# Altium project bela_cape.PrjPcb
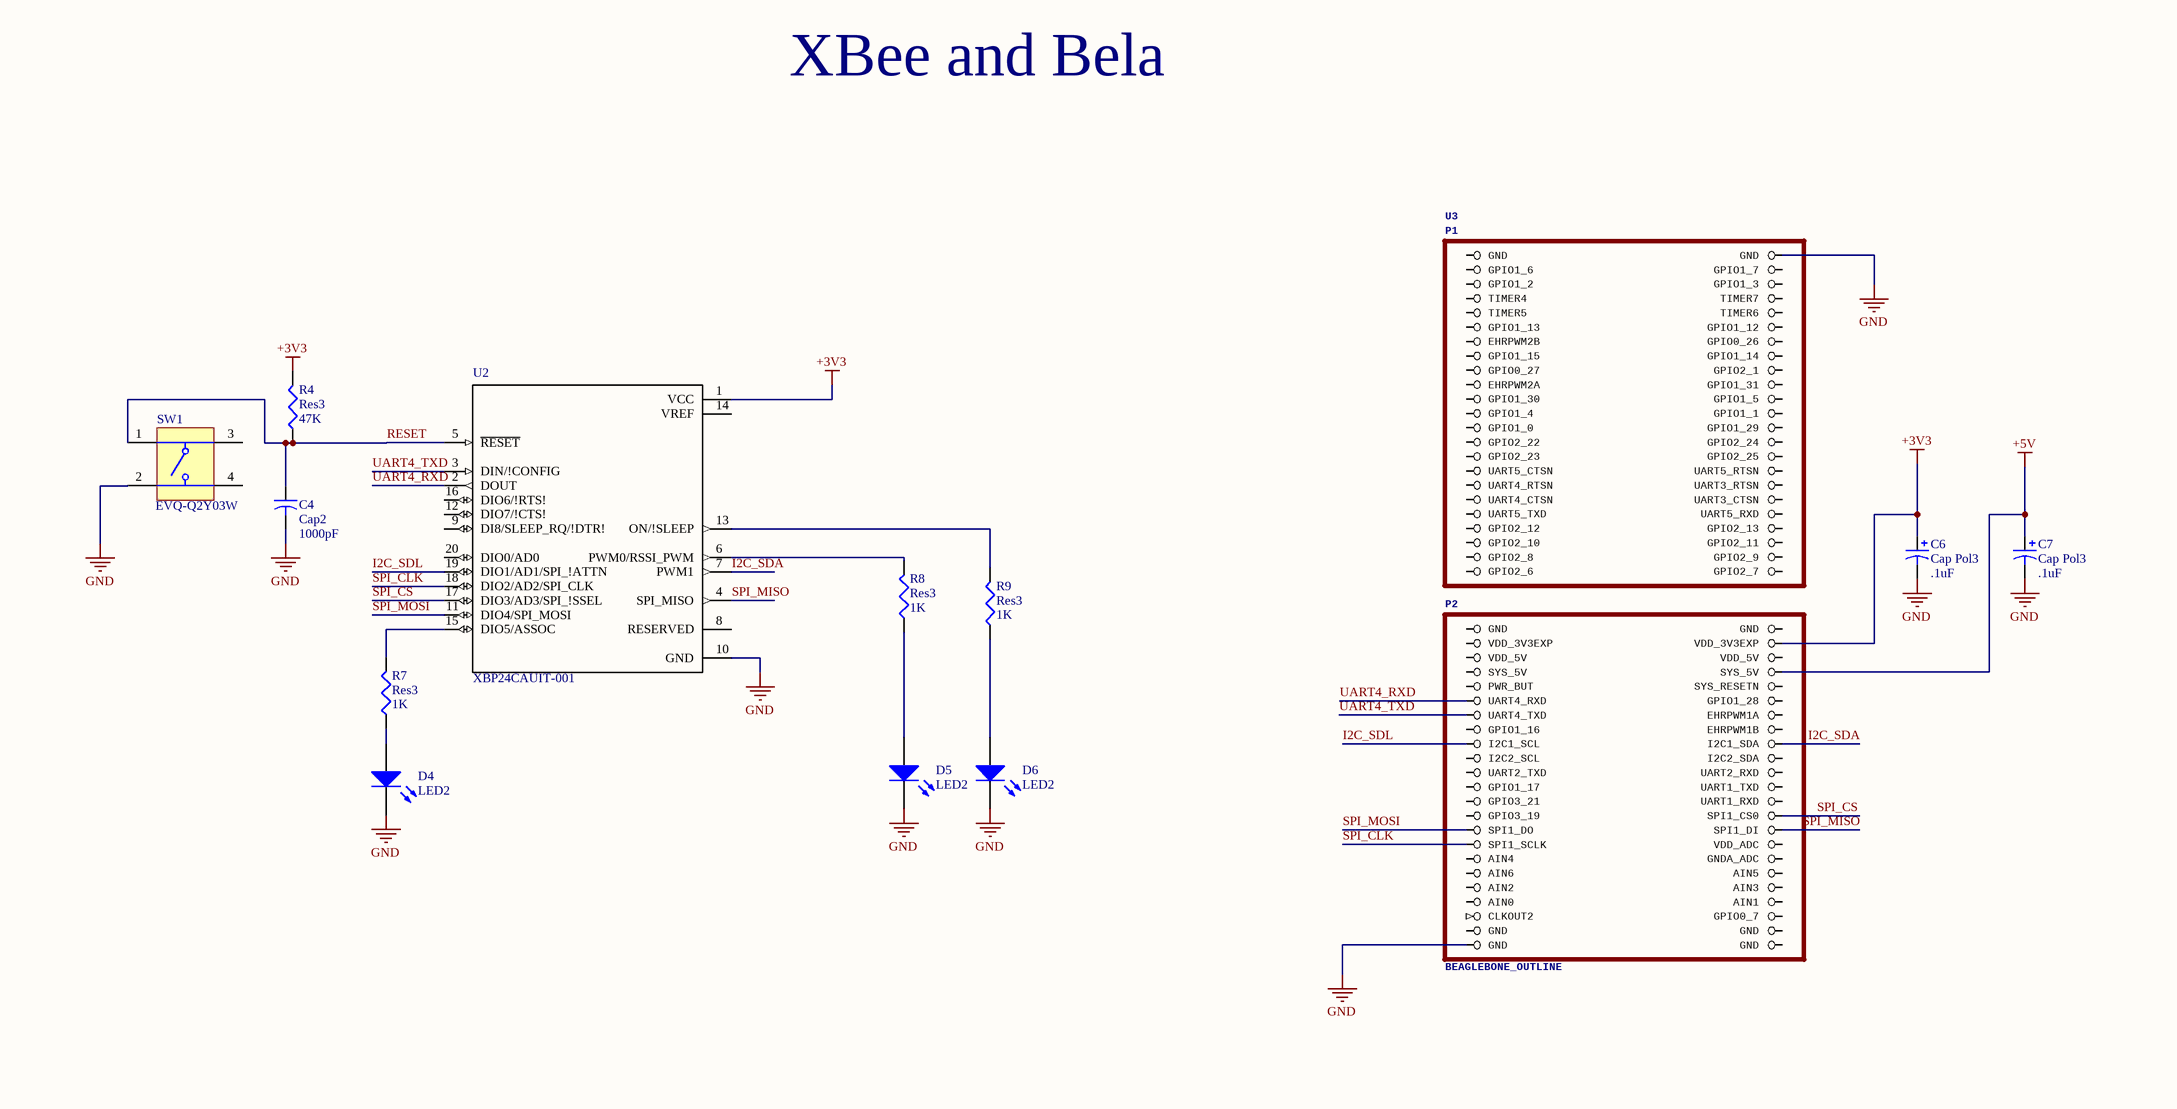
[diagram p0: bela_expansion_card_3.SchDoc]
3 sheets, 24 parts. Net scope: global (net labels, ports and power ports of the same name join across sheets).
Board file: bela_cape.PcbDoc
Sheets:
  bela_expansion_card_3.SchDoc
  bela_expansion_card_2.SchDoc
  bela_expansion_card_1.SchDoc

## Sheet bela_expansion_card_3.SchDoc
size 382 x 191 mm

### Parts
C4  Cap2  value 1000pF  [C0805]
C6  Cap Pol3  value .1uF  [C0805]
C7  Cap Pol3  value .1uF  [C0805]
D4  LED2  [3.2X1.6X1.1]
D5  LED2  [3.2X1.6X1.1]
D6  LED2  [3.2X1.6X1.1]
R4  Res3  value 47K  [6-0805_L]
R7  Res3  value 1K  [6-0805_L]
R8  Res3  value 1K  [6-0805_L]
R9  Res3  value 1K  [6-0805_L]
SW1  EVQ-Q2Y03W  [PNSC-EVQQ2_V]
U2  XBP24CAUIT-001  [*MODULE_XBP24CAUIT-001]
U3  BEAGLEBONE_OUTLINE  [BEAGLEBONE_SHIELD]

### Nets
+3V3: C6.1 R4.2 U2.1(VCC) U3.50(VDD_3V3EXP)
+5V: C7.1 U3.54(SYS_5V)
GND: C4.2 C6.2 C7.2 D4.2(K) D5.2(K) D6.2(K) SW1.2(B) U2.10(GND) U3.2(GND) U3.91(GND)
I2C_SDA: U2.7(PWM1) U3.64(I2C1_SDA)
I2C_SDL: U2.19(DIO1/AD1/SPI_!ATTN) U3.63(I2C1_SCL)
RESET: C4.1 R4.1 SW1.1(A) U2.5(~{RESET})
SPI_CLK: U2.18(DIO2/AD2/SPI_CLK) U3.77(SPI1_SCLK)
SPI_CS: U2.17(DIO3/AD3/SPI_!SSEL) U3.74(SPI1_CS0)
SPI_MISO: U2.4(SPI_MISO) U3.76(SPI1_DI)
SPI_MOSI: U2.11(DIO4/SPI_MOSI) U3.75(SPI1_DO)
UART4_RXD: U2.2(DOUT) U3.57(UART4_RXD)
UART4_TXD: U2.3(DIN/!CONFIG) U3.59(UART4_TXD)
NetD4_1: D4.1(A) R7.1
NetD5_1: D5.1(A) R8.1
NetD6_1: D6.1(A) R9.1
NetR7_2: R7.2 U2.15(DIO5/ASSOC)
NetR8_2: R8.2 U2.6(PWM0/RSSI_PWM)
NetR9_2: R9.2 U2.13(ON/!SLEEP)

Not connected (* = marked no-connect by the designer): SW1 3(A') 4(B'); U2 8(RESERVED) 9(DI8/SLEEP_RQ/!DTR!) 12(DIO7/!CTS!) 14(VREF) 16(DIO6/!RTS!) 20(DIO0/AD0); U3 1(GND) 3(GPIO1_6) 4(GPIO1_7) 5(GPIO1_2) 6(GPIO1_3) 7(TIMER4) 8(TIMER7) 9(TIMER5) 10(TIMER6) 11(GPIO1_13) 12(GPIO1_12) 13(EHRPWM2B) 14(GPIO0_26) 15(GPIO1_15) 16(GPIO1_14) 17(GPIO0_27) 18(GPIO2_1) 19(EHRPWM2A) 20(GPIO1_31) 21(GPIO1_30) 22(GPIO1_5) 23(GPIO1_4) 24(GPIO1_1) 25(GPIO1_0) 26(GPIO1_29) 27(GPIO2_22) 28(GPIO2_24) 29(GPIO2_23) 30(GPIO2_25) 31(UART5_CTSN) 32(UART5_RTSN) 33(UART4_RTSN) 34(UART3_RTSN) 35(UART4_CTSN) 36(UART3_CTSN) 37(UART5_TXD) 38(UART5_RXD) 39(GPIO2_12) 40(GPIO2_13) 41(GPIO2_10) 42(GPIO2_11) 43(GPIO2_8) 44(GPIO2_9) 45(GPIO2_6) 46(GPIO2_7) 47(GND) 48(GND) 49(VDD_3V3EXP) 51(VDD_5V) 52(VDD_5V) 53(SYS_5V) 55(PWR_BUT) 56(SYS_RESETN) 58(GPIO1_28) 60(EHRPWM1A) 61(GPIO1_16) 62(EHRPWM1B) 65(I2C2_SCL) 66(I2C2_SDA) 67(UART2_TXD) 68(UART2_RXD) 69(GPIO1_17) 70(UART1_TXD) 71(GPIO3_21) 72(UART1_RXD) 73(GPIO3_19) 78(VDD_ADC) 79(AIN4) 80(GNDA_ADC) 81(AIN6) 82(AIN5) 83(AIN2) 84(AIN3) 85(AIN0) 86(AIN1) 87(CLKOUT2) 88(GPIO0_7) 89(GND) 90(GND) 92(GND)

### Notes on the sheet
- XBee and Bela

### Library data of the parts
C4 = Cap2_4: Capacitor; Published: 23-Sep-2002; PackageReference: CAPR5-4X5; Publisher: Altium Limited; PackageDescription: Capacitor; 2 Leads
C6 C7 = Cap Pol3: Polarized Capacitor (Surface Mount); Published: 8-Jun-2000; LatestRevisionDate: 29-May-2009; LatestRevisionNote: IPC-7351 Footprint Added.; PackageReference: C0805; Publisher: Altium Limited; PackageDescription: Chip Capacitor
D4-D6 = LED2: Typical RED, GREEN, YELLOW, AMBER GaAs LED; Published: 8-Jun-2000; LatestRevisionDate: 17-Jul-2002; LatestRevisionNote: Re-released for DXP Platform.; PackageVersion: Feb-2002; PackageReference: 3.2X1.6X1.1; Publisher: Altium Limited; PackageDescription: SM LED; 2 Flat Leads
R4 R7-R9 = Res3: Resistor; Published: 8-Jun-2000; LatestRevisionDate: 29-May-2009; LatestRevisionNote: IPC-7351 Footprint Added.; PackageReference: J1-0603; Publisher: Altium Limited; PackageDescription: Chip Resistor
SW1 = CMP-2000-06232-1: Light Touch Switche, 3.5 N Force, Height 3.1 mm, -40 to 85 degC, 4-Pin SMD, RoHS, Tape and Reel; Manufacturer: Panasonic; Switch Terminals: Solder; Contact Current Rating: 20mA; Switch Operation: Off-On; External Length / Height: 3.1mm; External Depth: 1.8mm; Body Width: 6.5mm; No. of Ways: 1; Contact Voltage DC Max: 15V; Dielectric Strength VAC: 250V; Actuation Type: Top; Operating Force Min: 3.5N; Body Depth: 6mm; SVHC: NoSVHC(16-Dec-2013); Actuator / Cap Colour: White; No. of Mechanical Operations: 100000; Contact Resistance Max: 100mohm; Contact Configuration: SPST-NO; Datasheet Version: 09/2014; Mounting Technology: SurfaceMount; Height: 3.1mm; Datasheet URL: http://download.siliconexpert.com/pdfs/2014/10/4/5/54/9/232/pns_/manual/8atk0000ce28.pdf; Contact Current Max: 20mA; Package Description: 4-Pin Surface Mount Device, Body 6.5 x 6 mm; Contact Current DC Max: 20mA; Operating Temperature Max: 85°C; External Width: 6.5mm; Manufacturer URL: http://www.panasonic.com/; Package Reference: EVQQ2; Terminal Type: SMD; No. of Poles: 1; Contact Voltage AC Max: 250V; Operating Force: 3.5N; Contact Voltage DC Nom: 15V; Operating Temperature Min: -40°C; Series: EVQQ2
U2 = XBP24CAUIT-001: 802.15.4 Transceiver Module 2.4GHz Antenna Not Included, U.FL Through Hole; MF: Digi International; Package: Module Digi International; MP: XBP24CAUIT-001; SnapEDA_Link: https://www.snapeda.com/parts/XBP24CAUIT-001/Digi%20International/view-part/1219456/?ref=snap; Availability: Unavailable; Price: None; Value: *
U3 = BEAGLEBONE_OUTLINE: Should match A3 pinout - but not completely tested; GateName_1: G$1; SymbolName_1: BEAGLEBONE-1; LibraryName: adafruit; DeviceSetName: BEAGLEBONE_OUTLINE; P1: P1; P2: P2

## Sheet bela_expansion_card_2.SchDoc
size 153 x 116 mm
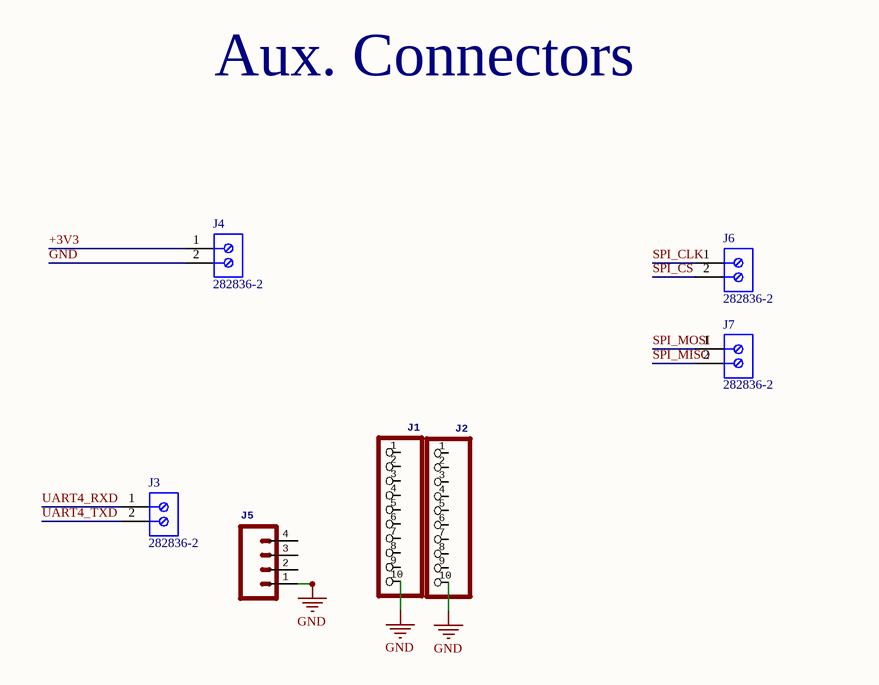
[diagram p1: bela_expansion_card_2.SchDoc]

### Parts
J1  PINHD-1X10  [HDR1X10]  (value not drawn)
J2  PINHD-1X10  [HDR1X10]  (value not drawn)
J3  282836-2  [TECO-282836-2_V]
J4  282836-2  [TECO-282836-2_V]
J5  M04PTH  [1X04]  (value not drawn)
J6  282836-2  [TECO-282836-2_V]
J7  282836-2  [TECO-282836-2_V]

### Nets
+3V3: J4.1
GND: J1.10 J2.10 J4.2 J5.1
SPI_CLK: J6.1
SPI_CS: J6.2
SPI_MISO: J7.2
SPI_MOSI: J7.1
UART4_RXD: J3.1
UART4_TXD: J3.2

Not connected (* = marked no-connect by the designer): J1 1 2 3 4 5 6 7 8 9; J2 1 2 3 4 5 6 7 8 9; J5 2 3 4

### Notes on the sheet
- Aux. Connectors

### Library data of the parts
J1 J2 = PINHD-1X10: PIN HEADER; GateName_1: A; SymbolName_1: PINHD10; LibraryName: pinhead; DeviceSetName: PINHD-1X10
J3 J4 J6 J7 = CMP-1684-00017-1: Female Header, Pitch 5 mm, 1 x 2 Position, Height 10 mm, Tail Length 3.5 mm, Rohs, Bulk; Manufacturer: TE Connectivity; Wire Gauge: 16-30AWG; Product Training Modules: Wire-to-BoardEurostyleTerminalBlocks; Clamp Material - Plating: Brass-NickelPlated; Voltage: 300V; Mating Orientation: HorizontalwithBoard; Current: 13.5A; Pitch: 0.197"(5.00mm); Screw Thread: M3; 3D Model: 282836-2.pdf; Other Names: 5ULV-02B / A98076; Dynamic Catalog: BuchananSeries; Number of Levels: 1; Torque - Screw: 0.68Nm(6Lb-In); Featured Product: EurostyleTerminalBlockConnectors; Positions Per Level: 2; Wire Termination: Screw-RisingCageClamp; Datasheet URL: http://www.te.com.cn/commerce/DocumentDelivery/DDEController?Action=showdoc&DocId=Catalog+Section%7F1308389_EUROSTYLE_TERMINAL_BLOCKS%7F0607%7Fpdf%7FEnglish%7FENG_CS_1308389_EUROSTYLE_TERMINAL_BLOCKS_0607.pdf%7F282836-2; Color: Green; Family: TerminalBlocks-WiretoBoard; RoHS Information: 282836-2StatementofCompliance; Standard Package: 300; Contact Material - Plating: Brass-TinPlated; Manufacturer URL: http://www.te.com; Housing Material: Polyamide(PA66),Nylon6/6; Features: Interlocking(Side); Package Description: Female Header, Pitch 5 mm, 1 x 2 Position, Height 10 mm, Tail Length 3.5 mm; Mounting Type: ThroughHole; Package Reference: THD; Packaging: Bulk; Series: Buchanan; Category: Connectors,Interconnects; Screw Material - Plating: Brass-NickelPlated
J5 = M04PTH: Header 4Standard 4-pin 0.1" header. Use with straight break away headers (SKU : PRT-00116), right angle break away headers (PRT-00553), swiss pins (PRT-00743), machine pins (PRT-00117), and female headers (PRT-00115). Molex polarized connector foot print use with SKU : PRT-08231 with associated crimp pins and housings. 1MM SMD Version SKU: PRT-10208; GateName_1: G$1; SymbolName_1: M04; DeviceName: PTH; MANEX: 258-0002845; LibraryName: SparkFun-Connectors; DeviceSetName: M04

## Sheet bela_expansion_card_1.SchDoc
size 241 x 175 mm
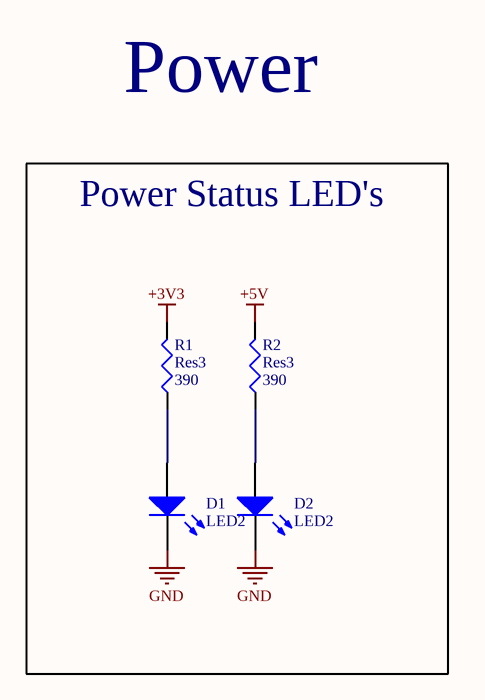
[diagram p2: bela_expansion_card_1.SchDoc]

### Parts
D1  LED2  [3.2X1.6X1.1]
D2  LED2  [3.2X1.6X1.1]
R1  Res3  value 390  [6-0805_L]
R2  Res3  value 390  [6-0805_L]

### Blocks framed on the sheet
Power Status LED's: D1 D2 R1 R2

### Nets
+3V3: R1.2
+5V: R2.2
GND: D1.2(K) D2.2(K)
NetD1_1: D1.1(A) R1.1
NetD2_1: D2.1(A) R2.1

### Notes on the sheet
- Power

### Library data of the parts
D1 D2 = LED2: as D4 on sheet bela_expansion_card_3; Published: 8-Jun-2000; LatestRevisionDate: 17-Jul-2002; LatestRevisionNote: Re-released for DXP Platform.; PackageVersion: Feb-2002; PackageReference: 3.2X1.6X1.1; Publisher: Altium Limited; PackageDescription: SM LED; 2 Flat Leads
R1 R2 = Res3: Resistor; Published: 8-Jun-2000; LatestRevisionDate: 29-May-2009; LatestRevisionNote: IPC-7351 Footprint Added.; PackageReference: J1-0603; Publisher: Altium Limited; PackageDescription: Chip Resistor

## Nets that join several sheets
+3V3: bela_expansion_card_3 (C6.1 R4.2 U2.1 U3.50), bela_expansion_card_2 (J4.1), bela_expansion_card_1 (R1.2)
+5V: bela_expansion_card_3 (C7.1 U3.54), bela_expansion_card_1 (R2.2)
GND: bela_expansion_card_3 (10 pins), bela_expansion_card_2 (J1.10 J2.10 J4.2 J5.1), bela_expansion_card_1 (D1.2 D2.2)
SPI_CLK: bela_expansion_card_3 (U2.18 U3.77), bela_expansion_card_2 (J6.1)
SPI_CS: bela_expansion_card_3 (U2.17 U3.74), bela_expansion_card_2 (J6.2)
SPI_MISO: bela_expansion_card_3 (U2.4 U3.76), bela_expansion_card_2 (J7.2)
SPI_MOSI: bela_expansion_card_3 (U2.11 U3.75), bela_expansion_card_2 (J7.1)
UART4_RXD: bela_expansion_card_3 (U2.2 U3.57), bela_expansion_card_2 (J3.1)
UART4_TXD: bela_expansion_card_3 (U2.3 U3.59), bela_expansion_card_2 (J3.2)